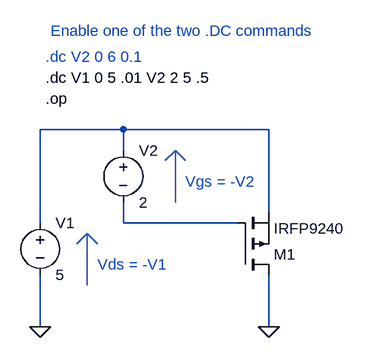
[diagram p0: schematic p-chan-sweep2.asc]
p-chan-sweep2.asc, the LTspice schematic file:
Version 4
SHEET 1 916 680
WIRE 32 -64 -96 -64
WIRE 256 -64 32 -64
WIRE 32 -32 32 -64
WIRE 256 64 256 -64
WIRE -96 80 -96 -64
WIRE 32 80 32 48
WIRE 208 80 32 80
WIRE -96 240 -96 160
WIRE 256 240 256 160
FLAG 256 240 0
FLAG -96 240 0
SYMBOL pmos 208 160 M180
SYMATTR InstName M1
SYMATTR Value IRFP9240
SYMBOL voltage 32 -48 R0
SYMATTR InstName V2
SYMATTR Value 2
SYMBOL voltage -96 64 R0
SYMATTR InstName V1
SYMATTR Value 5
TEXT -88 -144 Left 0 !.dc V1 0 5 .01 V2 2 5 .5
TEXT 128 16 Left 0 ;Vgs = -V2
TEXT -8 144 Left 0 ;Vds = -V1
TEXT -88 -112 Left 0 !.op
TEXT -88 -176 Left 0 ;.dc V2 0 6 0.1
TEXT -80 -216 Left 0 ;Enable one of the two .DC commands
LINE Normal 112 -32 112 48
LINE Normal 96 -16 112 -32
LINE Normal 112 -32 96 -16
LINE Normal 128 -16 112 -32
LINE Normal -24 96 -24 176
LINE Normal -40 112 -24 96
LINE Normal -24 96 -40 112
LINE Normal -8 112 -24 96

The netlist it stands for:
* p-chan-sweep2.asc
M1 0 N002 N001 N001 IRFP9240
V2 N001 N002 2
V1 N001 0 5
.model NMOS NMOS
.model PMOS PMOS
.lib standard.mos
.dc V1 0 5 .01 V2 2 5 .5
* Vgs = -V2
* Vds = -V1
.op
* .dc V2 0 6 0.1
* Enable one of the two .DC commands
.backanno
.end